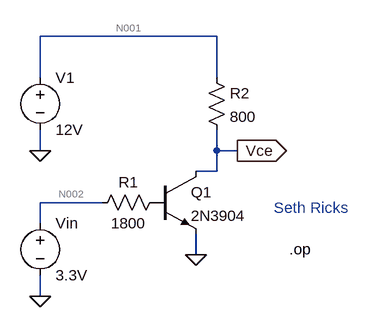
[diagram p0: schematic question_6.asc]
question_6.asc, the LTspice schematic file:
Version 4.1
SHEET 1 880 680
WIRE 224 -48 -48 -48
WIRE -48 16 -48 -48
WIRE 224 16 224 -48
WIRE -48 128 -48 96
WIRE 224 128 224 96
WIRE 256 128 224 128
WIRE 224 160 224 128
WIRE 224 160 192 160
WIRE 48 208 -48 208
WIRE -48 240 -48 208
WIRE 192 288 192 256
WIRE -48 352 -48 320
FLAG 192 288 0
FLAG -48 128 0
FLAG 256 128 Vce
IOPIN 256 128 Out
FLAG -48 352 0
SYMBOL voltage -48 0 R0
SYMATTR InstName V1
SYMATTR Value 12V
SYMBOL res 144 192 R90
WINDOW 0 0 56 VBottom 2
WINDOW 3 32 56 VTop 2
SYMATTR InstName R1
SYMATTR Value 1800
SYMBOL npn 128 160 R0
SYMATTR InstName Q1
SYMATTR Value 2N3904
SYMBOL res 208 0 R0
SYMATTR InstName R2
SYMATTR Value 800
SYMBOL voltage -48 224 R0
SYMATTR InstName Vin
SYMATTR Value 3.3V
TEXT 312 216 Left 2 ;Seth Ricks
TEXT 336 280 Left 2 !.op

The netlist it stands for:
* question_6.asc
V1 N001 0 12V
R1 P001 N002 1800
Q1 Vce P001 0 0 2N3904
R2 N001 Vce 800
Vin N002 0 3.3V
.model NPN NPN
.model PNP PNP
.lib standard.bjt
* Seth Ricks
.op
.backanno
.end

* Results of the author's LTspice run, read from the files saved beside the schematic
* Operating Point:
*   V(n001) = 12 V
*   V(n002) = 3.3 V
*   V(p001) = 765.6 mV
*   V(vce) = 40.5 mV
*   I(R1) = -1.408 mA
*   I(R2) = 14.95 mA
*   I(V1) = -14.95 mA
*   I(Vin) = -1.408 mA
*   Ib(Q1) = 1.408 mA
*   Ic(Q1) = 14.95 mA
*   Ie(Q1) = -16.36 mA
*   Is(Q1) = 0 A